# Altium schematic sheet MCU.SchDoc: QUTMS Shutdown V2 - MCU
size A4; Author: Jonn Dillon; Organization: QUT Motorsport; Address1: O-120; Address2: O Block; Address3: QUT Gardens Point; Address4: Brisbane, 4000; DocumentNumber: 8; SheetNumber: 8; SheetTotal: 10
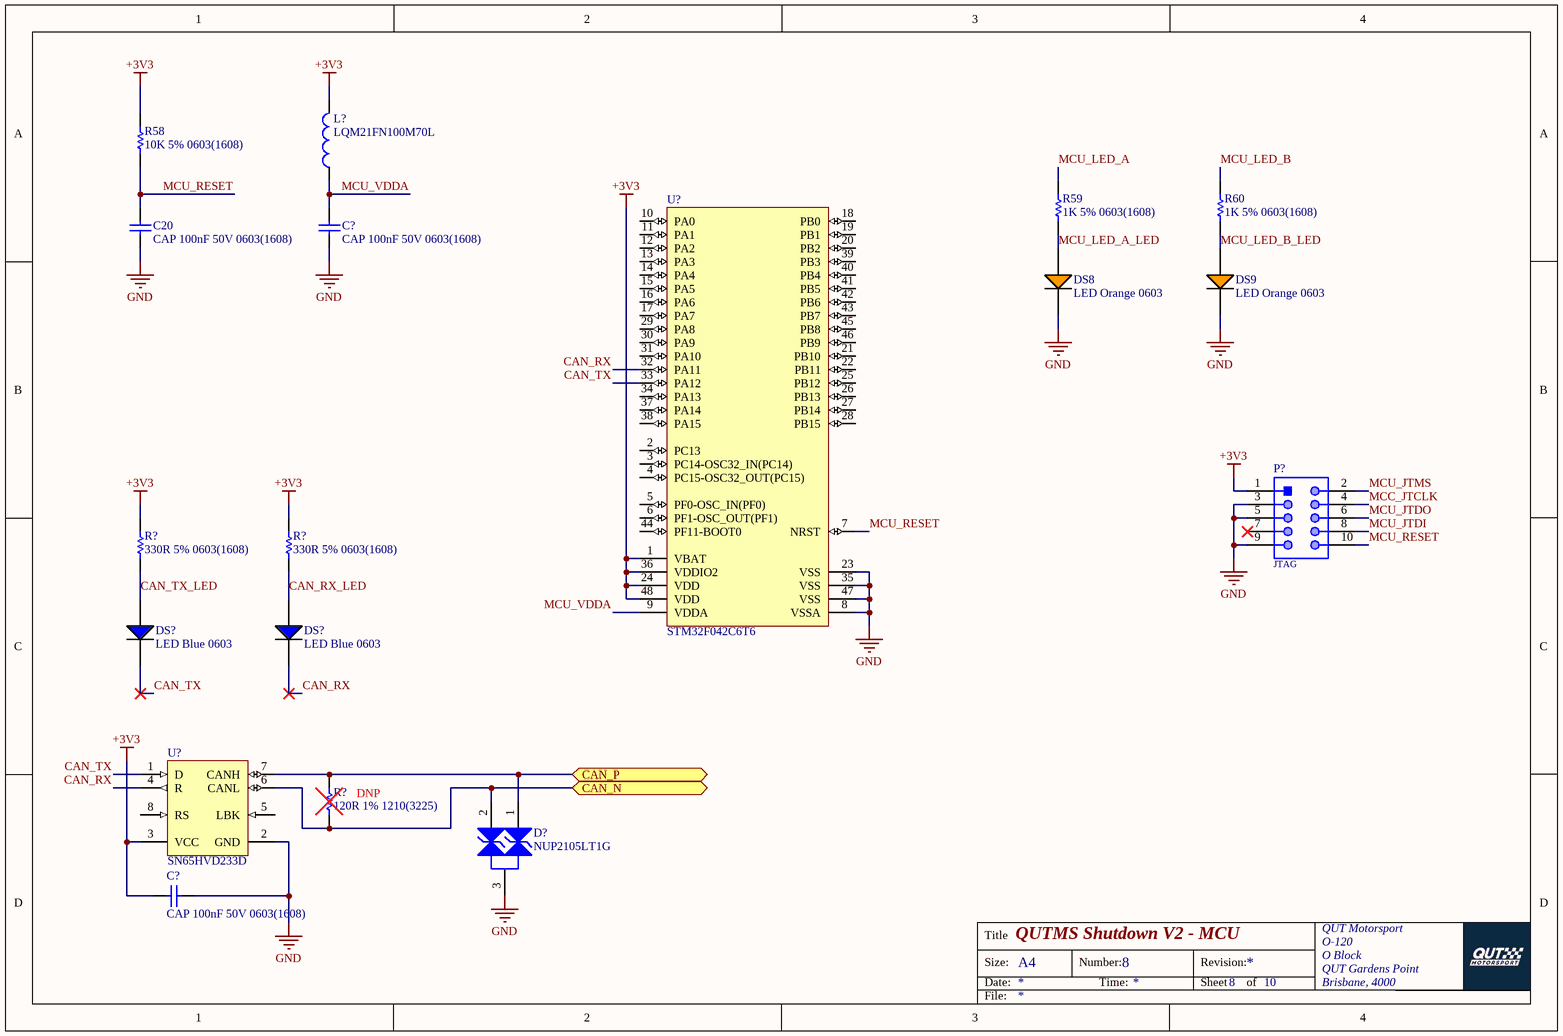
[diagram p0: MCU.SchDoc]

## Parts
(Parts that share a designator on the sheet are numbered #1, #2 ... from top to bottom, then left to right.)
C20  CAP 100nF 50V 0603(1608)  [CAPC0603(1608)100_L]
C?#1  CAP 100nF 50V 0603(1608)  [CAPC0603(1608)100_L]
C?#2  CAP 100nF 50V 0603(1608)  [CAPC0603(1608)100_L]
D?  NUP2105LT1G  [ONSC-SOT-23-3-318-08_V]
DS8  LED Orange 0603  [LED ORANGE 0603]
DS9  LED Orange 0603  [LED ORANGE 0603]
DS?#1  LED Blue 0603  [LED BLUE 0603]
DS?#2  LED Blue 0603  [LED BLUE 0603]
L?  LQM21FN100M70L  [MURA-IND0805_L]
P?  JTAG  [61301021121]
R58  10K 5% 0603(1608)  [RESC0603(1608)_N]
R59  1K 5% 0603(1608)  [RESC0603(1608)_L]
R60  1K 5% 0603(1608)  [RESC0603(1608)_L]
R?#1  330R 5% 0603(1608)  [RESC0603(1608)_L]
R?#2  330R 5% 0603(1608)  [RESC0603(1608)_L]
R?#3  120R 1% 1210(3225)  [RESC1210(3225)_M]
U?#1  STM32F042C6T6  [STM-LQFP48_M]
U?#2  SN65HVD233D  [D0008A_N]

## Ports
CAN_N (bidir), CAN_P (bidir)

## Nets
+3V3: C?#2.1 L?.2 P?.1 R58.2 R?#1.2 R?#2.2 U?#1.1(VBAT) U?#1.24(VDD) U?#1.36(VDDIO2) U?#1.48(VDD) U?#2.3(VCC)
GND: C20.2 C?#1.2 C?#2.2 D?.3(K) DS8.2(C) DS9.2(C) P?.3 P?.5 P?.9 U?#1.8(VSSA) U?#1.23(VSS) U?#1.35(VSS) U?#1.47(VSS) U?#2.2(GND)
CAN_N: D?.2(K) R?#3.1 U?#2.6(CANL) ; port CAN_N
CAN_P: D?.1(K) R?#3.2 U?#2.7(CANH) ; port CAN_P
CAN_RX: DS?#2.2(C) U?#1.32(PA11) U?#2.4(R)
CAN_RX_LED: DS?#2.1(A) R?#2.1
CAN_TX: DS?#1.2(C) U?#1.33(PA12) U?#2.1(D)
CAN_TX_LED: DS?#1.1(A) R?#1.1
MCC_JTCLK: P?.4
MCU_JTDI: P?.8
MCU_JTDO: P?.6
MCU_JTMS: P?.2
MCU_LED_A: R59.2
MCU_LED_A_LED: DS8.1(A) R59.1
MCU_LED_B: R60.2
MCU_LED_B_LED: DS9.1(A) R60.1
MCU_RESET: C20.1 P?.10 R58.1 U?#1.7(NRST)
MCU_VDDA: C?#1.1 L?.1 U?#1.9(VDDA)

Not connected (* = marked no-connect by the designer): P? 7*; U?#1 2(PC13) 3(PC14-OSC32_IN(PC14)) 4(PC15-OSC32_OUT(PC15)) 5(PF0-OSC_IN(PF0)) 6(PF1-OSC_OUT(PF1)) 10(PA0) 11(PA1) 12(PA2) 13(PA3) 14(PA4) 15(PA5) 16(PA6) 17(PA7) 18(PB0) 19(PB1) 20(PB2) 21(PB10) 22(PB11) 25(PB12) 26(PB13) 27(PB14) 28(PB15) 29(PA8) 30(PA9) 31(PA10) 34(PA13) 37(PA14) 38(PA15) 39(PB3) 40(PB4) 41(PB5) 42(PB6) 43(PB7) 44(PF11-BOOT0) 45(PB8) 46(PB9); U?#2 5(LBK) 8(RS)

## Notes on the sheet
- (near R?#3) DNP
- Title
- Size:
- Date:
- A4
- Number:
- Time:
- Revision:
- Sheet
- of
- File:

## Library data of the parts
C20 C?#1 C?#2 = CMP-1035-02591-1: CAP 100nF 50V ±5% 0603 (1608 Metric) Thickness 1mm SMD; Tolerance: Â±5%; Case-Metric: 1608; Case-EIA: 0603; Rated Voltage: 50 V; Max Thickness: 1 mm; Technology: SMT; Value: 100nF
D? = CMP-1063-00164-1: Dual Line CAN Bus Protector, 3-Pin SOT-23, Pb-Free, Tape and Reel; Manufacturer: On Semiconductor; IR Max (uA): 0.1; Number of Lines: 2; Direction: Bidirectional; C Max (pF): 30; PPK Max (W): 350; V(BR) Min (V): 26.2; ComponentLink3URL: http://www.onsemi.cn/pub_link/Collateral/318-08.PDF; Mounting Technology: Surface Mount; ComponentLink2Description: Datasheet; PartNumber: NUP2105LT1G; ComponentLink1URL: http://www.onsemi.com/; PackageVersion: Rev. AP, 11/2009; DatasheetVersion: Rev. 5; RoHS: Pb-Free; PackageReference: SOT-23-3-318-08; ComponentLink2URL: http://www.onsemi.cn/pub_link/Collateral/NUP2105L-D.PDF; ComponentLink1Description: Manufacturer URL; PackageDescription: 3-Pin Small Outline Transistor, Body 2.92 x 1.3 mm, Pitch 0.95 mm; Packing: Tape and Reel; ComponentLink3Description: Package Specification
L? = CMP-2000-06587-1: Fixed Inductor, 10 uH, +/-20%, -55 to 125 degC, 2-Pin SMD (0805), RoHS, Tape and Reel; Manufacturer: Murata; Tolerance (%): 20%; DC Resistance: 0.6; Inductance-Nom: 10H; Rated Current-Max: 100mA; Package Reference: IND0805; Case Size/Dimension: 0805; Manufacturer URL: http://www.murata.com/; Package Description: 2-Pin Surface Mount Device, Body 2 x 1.25 mm; Datasheet URL: http://psearch.en.murata.com/inductor/product/LQM21FN100M70%23.pdf; Mounting Technology: SurfaceMount; Datasheet Version: 05/2016
P? = CMP-1502-01084-1: THT Vertical Pin Header WR-PHD, Pitch 2.54 mm, Dual Row, 10 pins; Manufacturer: Wurth Elektronik; Working Voltage: 250VAC; Pitch: 2.54mm; Contact Resistance: 20mOhm; Gender: Male; Rated Current: 3A; Withstanding Voltage: 500VAC; Pin Number: 10; Operating Temperature: -40to105degC; Mounting Technology: THT; Publisher: WurthElektronik; Manufacturer URL: http://www.we-online.de; Part Number: 61301021121; Row Number: Dual; Packaging: Bag; Orientation: Vertical; Package Reference: 61301021121; Datasheet URL: https://katalog.we-online.de/em/datasheet/6130xx21121.pdf
R58 = CMP-1012-00098-1: 10K 0.1W 5% 0603 (1608 Metric)  SMD; Case-EIA: 0603; Value: 10000.00 Ohm; Case-Metric: 1608; Technology: SMT; Tolerance: 5 %; Power: 0.1 W
R59 R60 = CMP-1012-00074-1: 1K 0.1W 5% 0603 (1608 Metric)  SMD; Case-EIA: 0603; Case-Metric: 1608; Value: 1000.00 Ohm; Technology: SMT; Tolerance: 5 %; Power: 0.1 W
R?#1 R?#2 = CMP-1012-00062-1: 330R 0.1W 5% 0603 (1608 Metric)  SMD; Value: 330.00 Ohm; Case-EIA: 0603; Case-Metric: 1608; Tolerance: 5 %; Power: 0.1 W; Technology: SMT
R?#3 = CMP-1015-00405-1: 120R 0.5W 1% 1210 (3225 Metric)  SMD; Case-Metric: 3225; Value: 120.00 Ohm; Case-EIA: 1210; Technology: SMT; Tolerance: 1 %; Power: 0.5 W
U?#1 = CMP-0304-00103-2: ARM Cortex-M0 32-bit MCU, 32 KB Flash, 6 KB Internal RAM, 38 I/Os, 48-Pin LQFP, -40 to 85 degC, Tray; Manufacturer: STMicroelectronics; Operating Frequency(F) (Processor speed) (MHz): 48; FLASH Size (Prog) (kB): 32; Internal RAM Size (kB): 6; I/Os (High Current): 38; Supply Voltage(Vcc) min (V): 2; ComponentLink1URL: http://www.st.com/; Packing: Tray; Package Description: 48-Pin Low Profile Quad Flat Package, Body 7 x 7 mm, Pitch 0.5 mm; ComponentLink2URL: http://www.st.com/st-web-ui/static/active/en/resource/technical/document/datasheet/DM00105814.pdf; ComponentLink2Description: Datasheet; ComponentLink1Description: Manufacturer URL; Mounting Technology: Surface Mount; Core: ARM Cortex-M0; Package Reference: LQFP48; PartNumber: STM32F042C6T6; DatasheetVersion: Rev. 5
U?#2 = CMP-0315-00036-2: 3.3V CAN Transceiver with Standby Mode, Loop-back, 6 mA, -40 to 125 degC, 8-pin SOIC (D), Green (RoHS & no Sb/Br); Manufacturer: Texas Instruments; Receivers Per Package: 1; Bus Fault Voltage(V): +/-30; Rating: Catalog; ICC(Max)(mA): 6; Supply Voltage(s)(V): 3.3; Transient Pulse Protection(V): -100 to 100; PackageVersion: revM, Jun-2011; PackageReference: D0008A; ComponentLink1Description: Datasheet; Isolated: No; Footprint: PCA82C250, excludes pin5; DatasheetVersion: SLLS557F; PackageDescription: 8-Pin Plastic Small Outline Integrated Circuit, 4.9 x 3.9 mm, Pitch 1.27 mm Pitch; Features: Loop Back; Low Power Mode: Standby; SubFamily: CAN; Drivers Per Package: 1; Eco-Plan: Green (RoHS & no Sb/Br); ComponentLink1URL: http://www.ti.com/general/docs/lit/getliterature.tsp?genericPartNumber=SN65HVD233&fileType=pdf; PartNumber: SN65HVD233D; Code_JEDEC: MS-012AA; Mounting Technology: Surface Mount